# Altium schematic sheet WLAN and Bluetooth.SchDoc
size A4
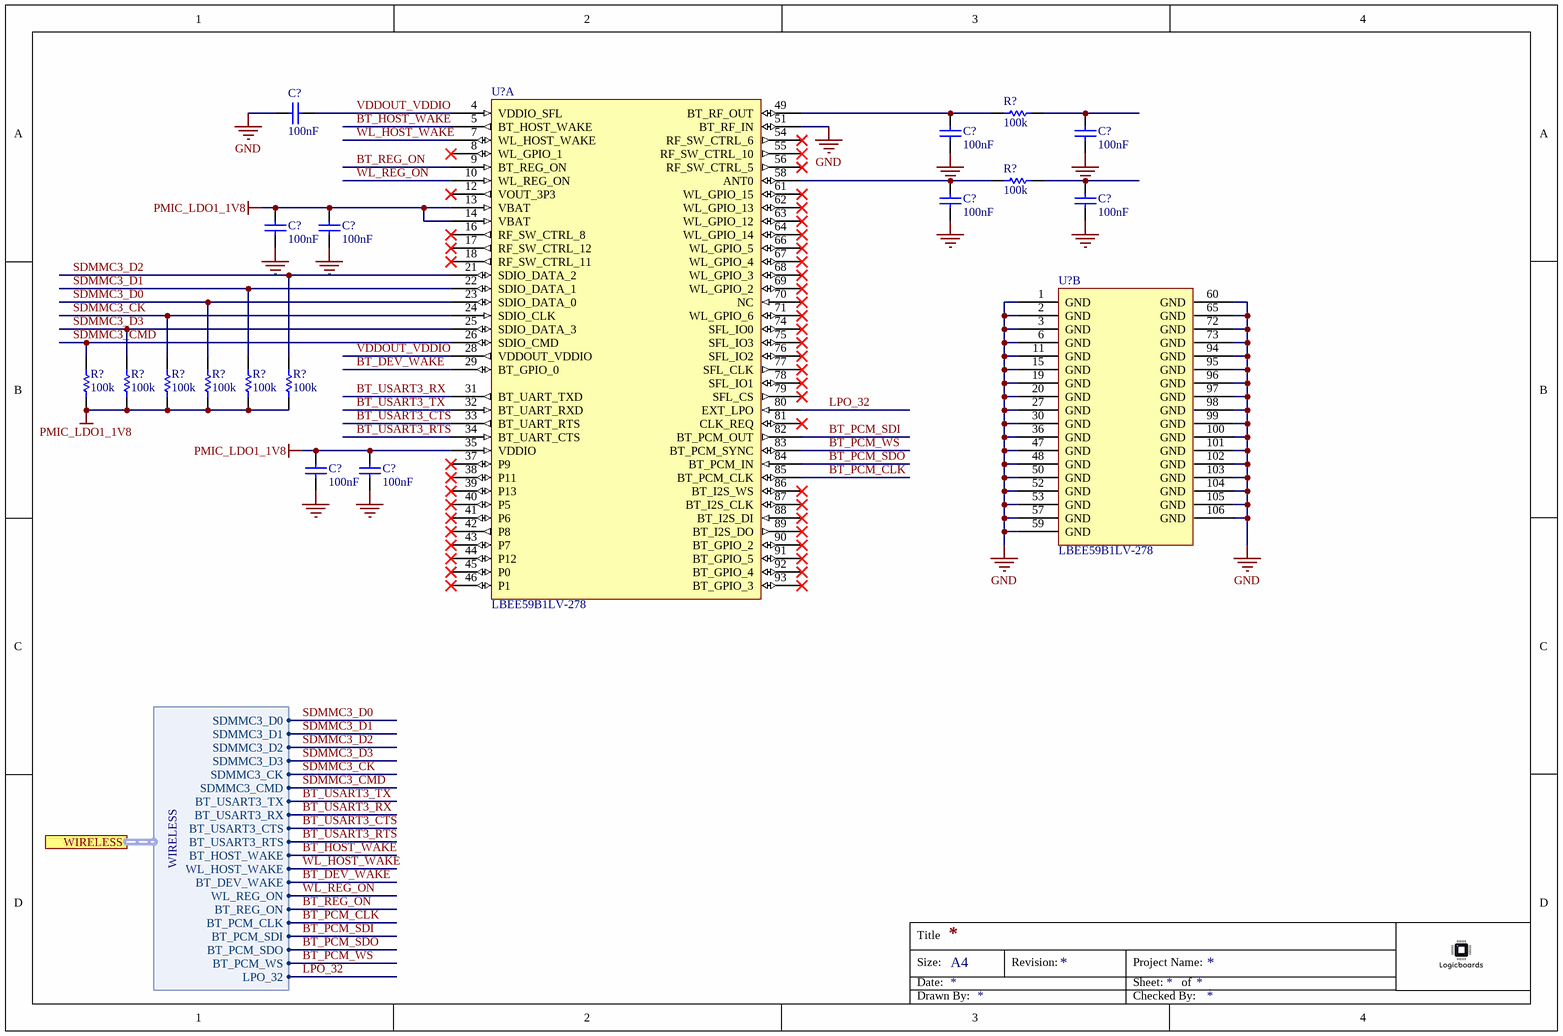
[diagram p0: WLAN and Bluetooth.SchDoc]

## Parts
(Parts that share a designator on the sheet are numbered #1, #2 ... from top to bottom, then left to right.)
C?#1  100nF
C?#2  100nF
C?#3  100nF
C?#4  100nF
C?#5  100nF
C?#6  100nF
C?#7  100nF
C?#8  100nF
C?#9  100nF
R?#1  100k
R?#2  100k
R?#3  100k
R?#4  100k
R?#5  100k
R?#6  100k
R?#7  100k
R?#8  100k
U?#1  LBEE59B1LV-278  (part A of 2)
U?#2  LBEE59B1LV-278  (part B of 2)

## Ports
WIRELESS (harness WIRELESS)

## Harnesses
WIRELESS: SDMMC3_D0, SDMMC3_D1, SDMMC3_D2, SDMMC3_D3, SDMMC3_CK, SDMMC3_CMD, BT_USART3_TX, BT_USART3_RX, BT_USART3_CTS, BT_USART3_RTS, BT_HOST_WAKE, WL_HOST_WAKE, BT_DEV_WAKE, WL_REG_ON, BT_REG_ON, BT_PCM_CLK, BT_PCM_SDI, BT_PCM_SDO, BT_PCM_WS, LPO_32

## Nets
GND: C?#1.1 C?#2.2 C?#3.2 C?#4.2 C?#5.2 C?#6.2 C?#7.2 C?#8.2 C?#9.2 U?#1.51(BT_RF_IN) U?#2.1(GND) U?#2.2(GND) U?#2.3(GND) U?#2.6(GND) U?#2.11(GND) U?#2.15(GND) U?#2.19(GND) U?#2.20(GND) U?#2.27(GND) U?#2.30(GND) U?#2.36(GND) U?#2.47(GND) U?#2.48(GND) U?#2.50(GND) U?#2.52(GND) U?#2.53(GND) U?#2.57(GND) U?#2.59(GND) U?#2.60(GND) U?#2.65(GND) U?#2.72(GND) U?#2.73(GND) U?#2.94(GND) U?#2.95(GND) U?#2.96(GND) U?#2.97(GND) U?#2.98(GND) U?#2.99(GND) U?#2.100(GND) U?#2.101(GND) U?#2.102(GND) U?#2.103(GND) U?#2.104(GND) U?#2.105(GND) U?#2.106(GND)
PMIC_LDO1_1V8: C?#6.1 C?#7.1 C?#8.1 C?#9.1 R?#3.1 R?#4.1 R?#5.1 R?#6.1 R?#7.1 R?#8.1 U?#1.13(VBAT) U?#1.14(VBAT) U?#1.35(VDDIO)
BT_DEV_WAKE: U?#1.29(BT_GPIO_0) ; port WIRELESS.BT_DEV_WAKE
BT_HOST_WAKE: U?#1.5(BT_HOST_WAKE) ; port WIRELESS.BT_HOST_WAKE
BT_PCM_CLK: U?#1.85(BT_PCM_CLK) ; port WIRELESS.BT_PCM_CLK
BT_PCM_SDI: U?#1.82(BT_PCM_OUT) ; port WIRELESS.BT_PCM_SDI
BT_PCM_SDO: U?#1.84(BT_PCM_IN) ; port WIRELESS.BT_PCM_SDO
BT_PCM_WS: U?#1.83(BT_PCM_SYNC) ; port WIRELESS.BT_PCM_WS
BT_REG_ON: U?#1.9(BT_REG_ON) ; port WIRELESS.BT_REG_ON
BT_USART3_CTS: U?#1.33(BT_UART_RTS) ; port WIRELESS.BT_USART3_CTS
BT_USART3_RTS: U?#1.34(BT_UART_CTS) ; port WIRELESS.BT_USART3_RTS
BT_USART3_RX: U?#1.31(BT_UART_TXD) ; port WIRELESS.BT_USART3_RX
BT_USART3_TX: U?#1.32(BT_UART_RXD) ; port WIRELESS.BT_USART3_TX
LPO_32: U?#1.80(EXT_LPO) ; port WIRELESS.LPO_32
SDMMC3_CK: R?#5.2 U?#1.24(SDIO_CLK) ; port WIRELESS.SDMMC3_CK
SDMMC3_CMD: R?#3.2 U?#1.26(SDIO_CMD) ; port WIRELESS.SDMMC3_CMD
SDMMC3_D0: R?#6.2 U?#1.23(SDIO_DATA_0) ; port WIRELESS.SDMMC3_D0
SDMMC3_D1: R?#7.2 U?#1.22(SDIO_DATA_1) ; port WIRELESS.SDMMC3_D1
SDMMC3_D2: R?#8.2 U?#1.21(SDIO_DATA_2) ; port WIRELESS.SDMMC3_D2
SDMMC3_D3: R?#4.2 U?#1.25(SDIO_DATA_3) ; port WIRELESS.SDMMC3_D3
VDDOUT_VDDIO: C?#1.2 U?#1.4(VDDIO_SFL) U?#1.28(VDDOUT_VDDIO)
WL_HOST_WAKE: U?#1.7(WL_HOST_WAKE) ; port WIRELESS.WL_HOST_WAKE
WL_REG_ON: U?#1.10(WL_REG_ON) ; port WIRELESS.WL_REG_ON
NetC?#2_1: C?#2.1 R?#1.1 U?#1.49(BT_RF_OUT)
NetC?#3_1: C?#3.1 R?#1.2
NetC?#4_1: C?#4.1 R?#2.1 U?#1.58(ANT0)
NetC?#5_1: C?#5.1 R?#2.2

Not connected (* = marked no-connect by the designer): U?#1 8(WL_GPIO_1)* 12(VOUT_3P3)* 16(RF_SW_CTRL_8)* 17(RF_SW_CTRL_12)* 18(RF_SW_CTRL_11)* 37(P9)* 38(P11)* 39(P13)* 40(P5)* 41(P6)* 42(P8)* 43(P7)* 44(P12)* 45(P0)* 46(P1)* 54(RF_SW_CTRL_6)* 55(RF_SW_CTRL_10)* 56(RF_SW_CTRL_5)* 61(WL_GPIO_15)* 62(WL_GPIO_13)* 63(WL_GPIO_12)* 64(WL_GPIO_14)* 66(WL_GPIO_5)* 67(WL_GPIO_4)* 68(WL_GPIO_3)* 69(WL_GPIO_2)* 70(NC)* 71(WL_GPIO_6)* 74(SFL_IO0)* 75(SFL_IO3)* 76(SFL_IO2)* 77(SFL_CLK)* 78(SFL_IO1)* 79(SFL_CS)* 81(CLK_REQ)* 86(BT_I2S_WS)* 87(BT_I2S_CLK)* 88(BT_I2S_DI)* 89(BT_I2S_DO)* 90(BT_GPIO_2)* 91(BT_GPIO_5)* 92(BT_GPIO_4)* 93(BT_GPIO_3)*

## Notes on the sheet
- Title
- Size:
- Date:
- A4
- Revision:
- Sheet:
- Project Name:
- of
- Drawn By:
- Checked By:

## Library data of the parts
C?#1-C?#9 = CAP_SMD: Capacitor MLCC; Tolerance: 10%; Dielectric: X5R; Voltage Rating: 6.3V; Supplier 1: Mouser; Manufacturer 1: *; Manufacturer Part Number 1: *; RoHS: Yes; Mount: Surface Mount; Package: *; Capacitance: *; Length: *; Lead Free: Lead Free; Supplier Part Number 1: *; Supplier 2: Digikey; Supplier Part Number 2: *; Value: 100nF
R?#1-R?#8 = RES_SMD: General Purpose Chip Resistor Thick Film; Supplier 1: Mouser; RoHS: Yes; Category: Resistors; RoHS Compliant: Yes; Resistance: *; Supplier 2: Digikey; Supplier Part Number 2: *; Package: *; Value: 100k
U?#1 U?#2 = LBEE59B1LV-278: Module Wi-Fi 11a/b/g/n + Bluetooth 5.0, 3.2V to 4.4V 106-Pin LGA T/R; Manufacturer 1: Murata; Supplier 1: Mouser; Manufacturer Part Number 1: LBEE59B1LV-278; RoHS: No; Category: RF Receivers, Transceivers; Supplier 2: Digi-Key; Datasheet: https://wireless.murata.com/pub/RFM/data/type1lv.pdf; Supplier Part Number 2: 490-18384-1-ND; Supplier Part Number 1: 81-LBEE59B1LV-278